# Altium schematic sheet PAGE2 - USB to JTAG I_F.SchDoc
size 386 x 246 mm
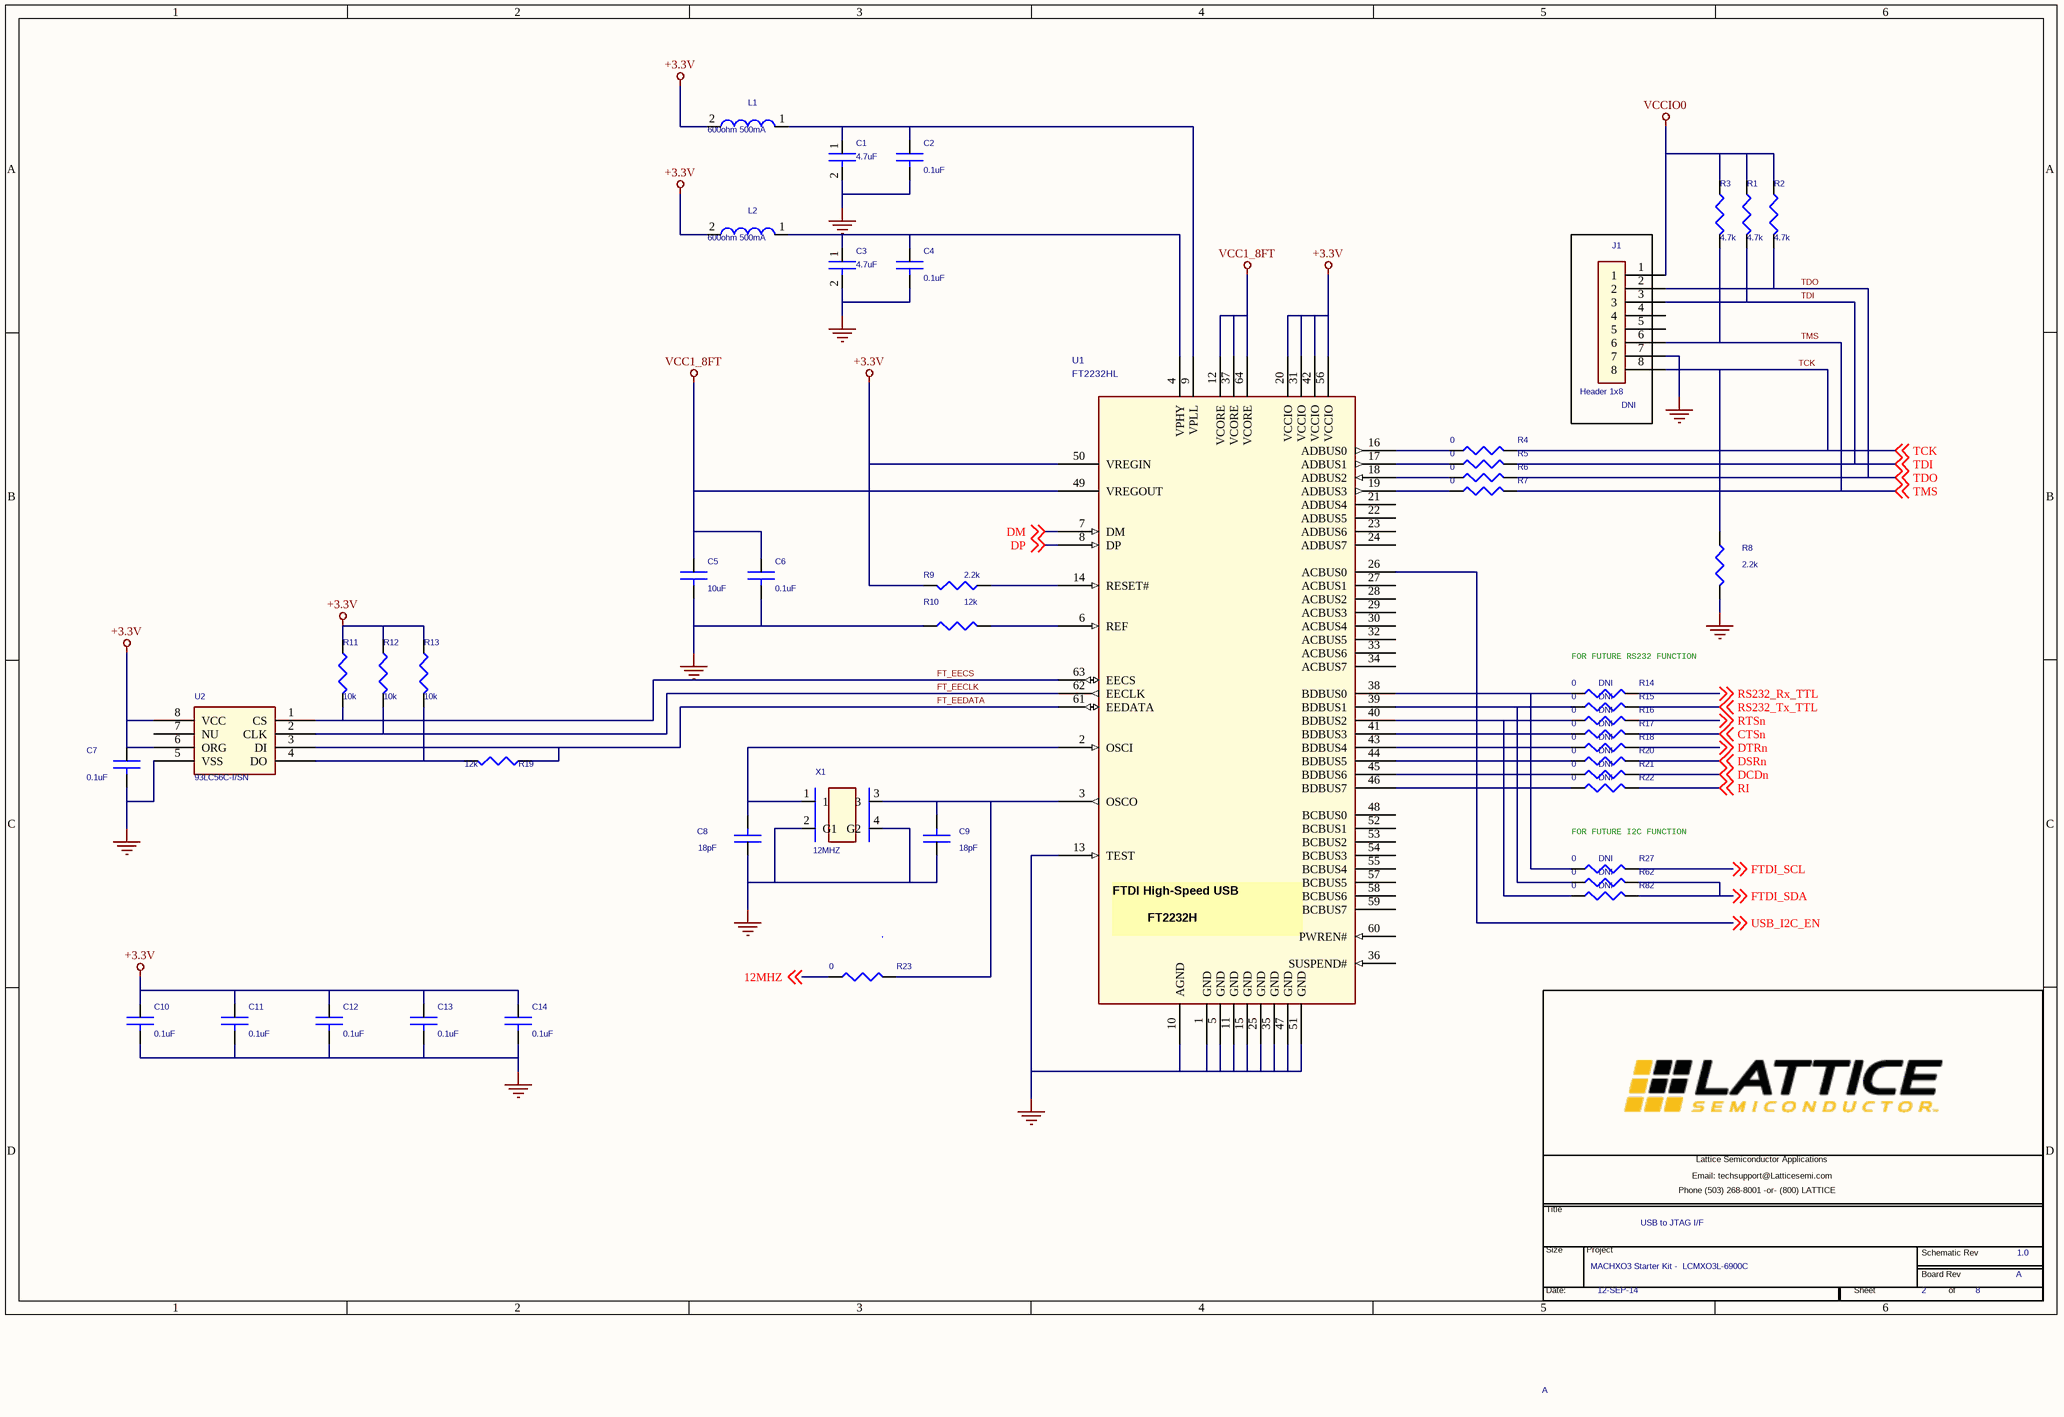
[diagram p0: PAGE2 - USB to JTAG I_F.SchDoc]

## Parts
*  Project Name: MACHXO3 Starter Kit -  LCMXO3L-6900C  Title: USB to JTAG I/F  Page Number: 2  Page Count: 8  RevCode: 1.0  Page Size: A  Date:: 12-SEP-14  (hidden comment: Lattice Title Block New Brand)  (graphical)
C1  4.7uF  [cc0603]
C2  0.1uF  [cc0402]
C3  4.7uF  [cc0603]
C4  0.1uF  [cc0402]
C5  10uF  [cc0603]
C6  0.1uF  [cc0402]
C7  0.1uF  [cc0402]
C8  18pF  [cc0402]
C9  18pF  [cc0402]
C10  0.1uF  [cc0402]
C11  0.1uF  [cc0402]
C12  0.1uF  [cc0402]
C13  0.1uF  [cc0402]
C14  0.1uF  [cc0402]
J1  Header 1x8  Assy: DNI  [hdr_amp_87220_8_1x8_100]
L1  600ohm 500mA  [FB0603]
L2  600ohm 500mA  [FB0603]
R1  4.7k  [cr0402]
R2  4.7k  [cr0402]
R3  4.7k  [cr0402]
R4  0  [cr0603]
R5  0  [cr0603]
R6  0  [cr0603]
R7  0  [cr0603]
R8  2.2k  [cr0402]
R9  2.2k  [cr0402]
R10  12k  [cr0402]
R11  10k  [R0402]
R12  10k  [R0402]
R13  10k  [R0402]
R14  0  Assy: DNI  [cr0603]
R15  0  Assy: DNI  [cr0603]
R16  0  Assy: DNI  [cr0603]
R17  0  Assy: DNI  [cr0603]
R18  0  Assy: DNI  [cr0603]
R19  12k  [cr0402]
R20  0  Assy: DNI  [cr0603]
R21  0  Assy: DNI  [cr0603]
R22  0  Assy: DNI  [cr0603]
R23  0  [cr0603]
R27  0  Assy: DNI  [cr0603]
R62  0  Assy: DNI  [cr0603]
R82  0  Assy: DNI  [cr0603]
U1  FT2232HL  [tqfp64_0p5_12p2x12p2_h1p6]
U2  93LC56C-I/SN  [so8_50_244]
X1  12MHZ  [crystal_4p_3p2x2p5]

## Nets
+3.3V: C7.1 C10.1 C11.1 C12.1 C13.1 C14.1 L1.2 L2.2 R9.2 R11.1 R12.1 R13.1 U1.20(VCCIO) U1.31(VCCIO) U1.42(VCCIO) U1.50(VREGIN) U1.56(VCCIO) U2.6(ORG) U2.8(VCC)
GND: C1.2 C2.2 C3.2 C4.2 C5.2 C6.2 C7.2 C8.1 C9.1 C10.2 C11.2 C12.2 C13.2 C14.2 J1.7 R8.2 R10.1 U1.1(GND) U1.5(GND) U1.10(AGND) U1.11(GND) U1.13(TEST) U1.15(GND) U1.25(GND) U1.35(GND) U1.47(GND) U1.51(GND) U2.5(VSS) X1.2(G1) X1.4(G2)
VCC1_8FT: C5.1 C6.1 U1.12(VCORE) U1.37(VCORE) U1.49(VREGOUT) U1.64(VCORE)
VCCIO0: J1.1 R1.1 R2.1 R3.1
12MHZ: R23.1 ; off-sheet 12MHZ
CTSn: R17.2 ; off-sheet CTSn
DCDn: R21.2 ; off-sheet DCDn
DM: U1.7(DM) ; off-sheet DM
DP: U1.8(DP) ; off-sheet DP
DSRn: R20.2 ; off-sheet DSRn
DTRn: R18.2 ; off-sheet DTRn
FT_EECLK: R12.2 U1.62(EECLK) U2.2(CLK)
FT_EECS: R11.2 U1.63(EECS) U2.1(CS)
FT_EEDATA: R19.1 U1.61(EEDATA) U2.3(DI)
FTDI_SCL: R27.2 ; off-sheet FTDI_SCL
FTDI_SDA: R62.2 R82.2 ; off-sheet FTDI_SDA
RI: R22.2 ; off-sheet RI
RS232_Rx_TTL: R14.2 ; off-sheet RS232_Rx_TTL
RS232_Tx_TTL: R15.2 ; off-sheet RS232_Tx_TTL
RTSn: R16.2 ; off-sheet RTSn
TCK: J1.8 R4.2 R8.1 ; off-sheet TCK
TDI: J1.3 R1.2 R5.2 ; off-sheet TDI
TDO: J1.2 R2.2 R6.2 ; off-sheet TDO
TMS: J1.6 R3.2 R7.2 ; off-sheet TMS
USB_I2C_EN: U1.26(ACBUS0) ; off-sheet USB_I2C_EN
NetC1_1: C1.1 C2.1 L1.1 U1.9(VPLL)
NetC3_1: C3.1 C4.1 L2.1 U1.4(VPHY)
NetC8_2: C8.2 U1.2(OSCI) X1.1
NetC9_2: C9.2 R23.2 U1.3(OSCO) X1.3
NetR4_1: R4.1 U1.16(ADBUS0)
NetR5_1: R5.1 U1.17(ADBUS1)
NetR6_1: R6.1 U1.18(ADBUS2)
NetR7_1: R7.1 U1.19(ADBUS3)
NetR9_1: R9.1 U1.14(RESET#)
NetR10_2: R10.2 U1.6(REF)
NetR13_2: R13.2 R19.2 U2.4(DO)
NetR14_1: R14.1 R27.1 U1.38(BDBUS0)
NetR15_1: R15.1 R62.1 U1.39(BDBUS1)
NetR16_1: R16.1 R82.1 U1.40(BDBUS2)
NetR17_1: R17.1 U1.41(BDBUS3)
NetR18_1: R18.1 U1.43(BDBUS4)
NetR20_1: R20.1 U1.44(BDBUS5)
NetR21_1: R21.1 U1.45(BDBUS6)
NetR22_1: R22.1 U1.46(BDBUS7)

Not connected (* = marked no-connect by the designer): J1 4 5; U1 21(ADBUS4) 22(ADBUS5) 23(ADBUS6) 24(ADBUS7) 27(ACBUS1) 28(ACBUS2) 29(ACBUS3) 30(ACBUS4) 32(ACBUS5) 33(ACBUS6) 34(ACBUS7) 36(SUSPEND#) 48(BCBUS0) 52(BCBUS1) 53(BCBUS2) 54(BCBUS3) 55(BCBUS4) 57(BCBUS5) 58(BCBUS6) 59(BCBUS7) 60(PWREN#); U2 7(NU)

## Notes on the sheet
- FOR FUTURE RS232 FUNCTION
- FOR FUTURE I2C FUNCTION
- (in symbol FT2232HL) FTDI High-Speed USB / FT2232H
- (in symbol Lattice Title Block New Brand) Lattice Semiconductor Applications; Email: techsupport@Latticesemi.com; Phone (503) 268-8001 -or- (800) LATTICE; Title; Size; Project; Schematic Rev; Board Rev; Date:; Sheet; of

## Library data of the parts
C1 C3 = 4u7_0603: CAP CER 4.7UF 6.3V 10% X5R 0603; Manufacturer: Panasonic; Part Number: 102033; Manufacturer Part Number: ECJ-1VB0J475K; Class: Discrete; Tolerance: 5%; Voltage: 6.3V; Digikey P/N: PCC2396CT-ND
C2 C4 C6 C7 C10-C14 = 0u1_0402: CAP CER 0.1UF 16V 10% X7R 0402; Manufacturer Part Number: C0402C104K4RACTU; Manufacturer: Kemet; Class: Discrete; Digikey P/N: 399-3521-2-ND
C5 = 10uF_0603: CAP CER 10UF 10V 20% X5R 0603; Manufacturer Part Number: LMK107BJ106MALTD; Manufacturer: Taiyo Yuden; Class: Discrete; Digikey P/N: 587-2562-1-ND
C8 C9 = 0u1_0402: CAP CER 18PF 25V 10% NP0 0402; Manufacturer Part Number: C0402C180K3GACTU; Manufacturer: Kemet; Class: Discrete; Digikey P/N: C0402C180K3GACTU-ND
J1 = header1x8_100: CONN HEADER 8POS .100 VERT TIN; Manufacturer Part Number: 0022284081; Manufacturer: Molex; Class: IO; Digikey P/N: WM50017-08-ND
L1 L2 = FB0603: FERRITE CHIP 600 OHM 500MA 0603; Manufacturer Part Number: BLM18AG601SN1D; Manufacturer: Murata; Class: Discrete; Digikey P/N: 490-1014-1-ND
R1-R3 = 5k1_0402: RES 4.70K OHM 1/10W 1% 0603 SMD; Manufacturer: Vishay; Manufacturer Part Number: CRCW06034K70FKEA; Class: Discrete; Digikey P/N: 541-4.70KHTR-ND
R4-R7 R14-R18 R20-R23 R27 R62 R82 = 0R_0603: RES 0.0 OHM 1/10W JUMP 0603 SMD; Manufacturer Part Number: RC0603JR-070RL; Manufacturer: Yageo; Class: Discrete; Digikey P/N: 311-0.0GRTR-ND
R8 R9 = 5k1_0402: RES 2.20K OHM 1/10W 1% 0603 SMD; Manufacturer: Vishay; Manufacturer Part Number: CRCW06032K20FKEA; Class: Discrete; Digikey P/N: 541-2.20KHTR-ND
R10 R19 = 10k_0402: RES 12K OHM 1/10W 1% 0603 SMD; Manufacturer Part Number: RC0603FR-0712KL; Manufacturer: Yageo; Class: Discrete; Digikey P/N: 311-12.0KHRTR-ND; Tolerance: 1%
R11-R13 = RES_10K_1W16_0402_5P: RES 10K OHM 1/10W 5% 0603; Manufacturer Part Number: RMCF0603JT10K0; TC2: 0; MFG: Stackpole Electronics Inc; MFG P/N: RMCF0402JT10K0; MAX_TEMP: RTMAX; DIST: FLAT; Total Area(sq-mm): 0.5; Unit Price (USD): 0.02; TC1: 0; Wattage: 1/10W; Width(mm): 0.5; Length(mm): 1; Manufacturer: Stackpole Electronics Inc; Digikey P/N: RMCF0603JT10K0TR-ND
U1 = FT2232HL: IC USB HS DUAL UART/FIFO 64-LQFP; Manufacturer: FTDI; Digikey P/N: 768-1024-1-ND; Manufacturer Part Number: FT2232HL; Class: IC
U2 = 93LC56_SO8_0: IC EEPROM 2KBIT 3MHZ 8SOIC; Manufacturer: Microchip; Class: IC; Manufacturer Part Number: 93LC56C-I/SN; Digikey P/N: 93LC56C-I/SN-ND
X1 = crystal-3p2x2p5: CRYSTAL 12MHZ 18PF SMD; Manufacturer: TXC; Manufacturer Part Number: 7M-12.000MAAJ-T; Class: IC; Digikey P/N: 887-1121-2-ND
* = Lattice Title Block New Brand: Board Rev: A